# EAGLE design 11Dof (EAGLE 6.2)
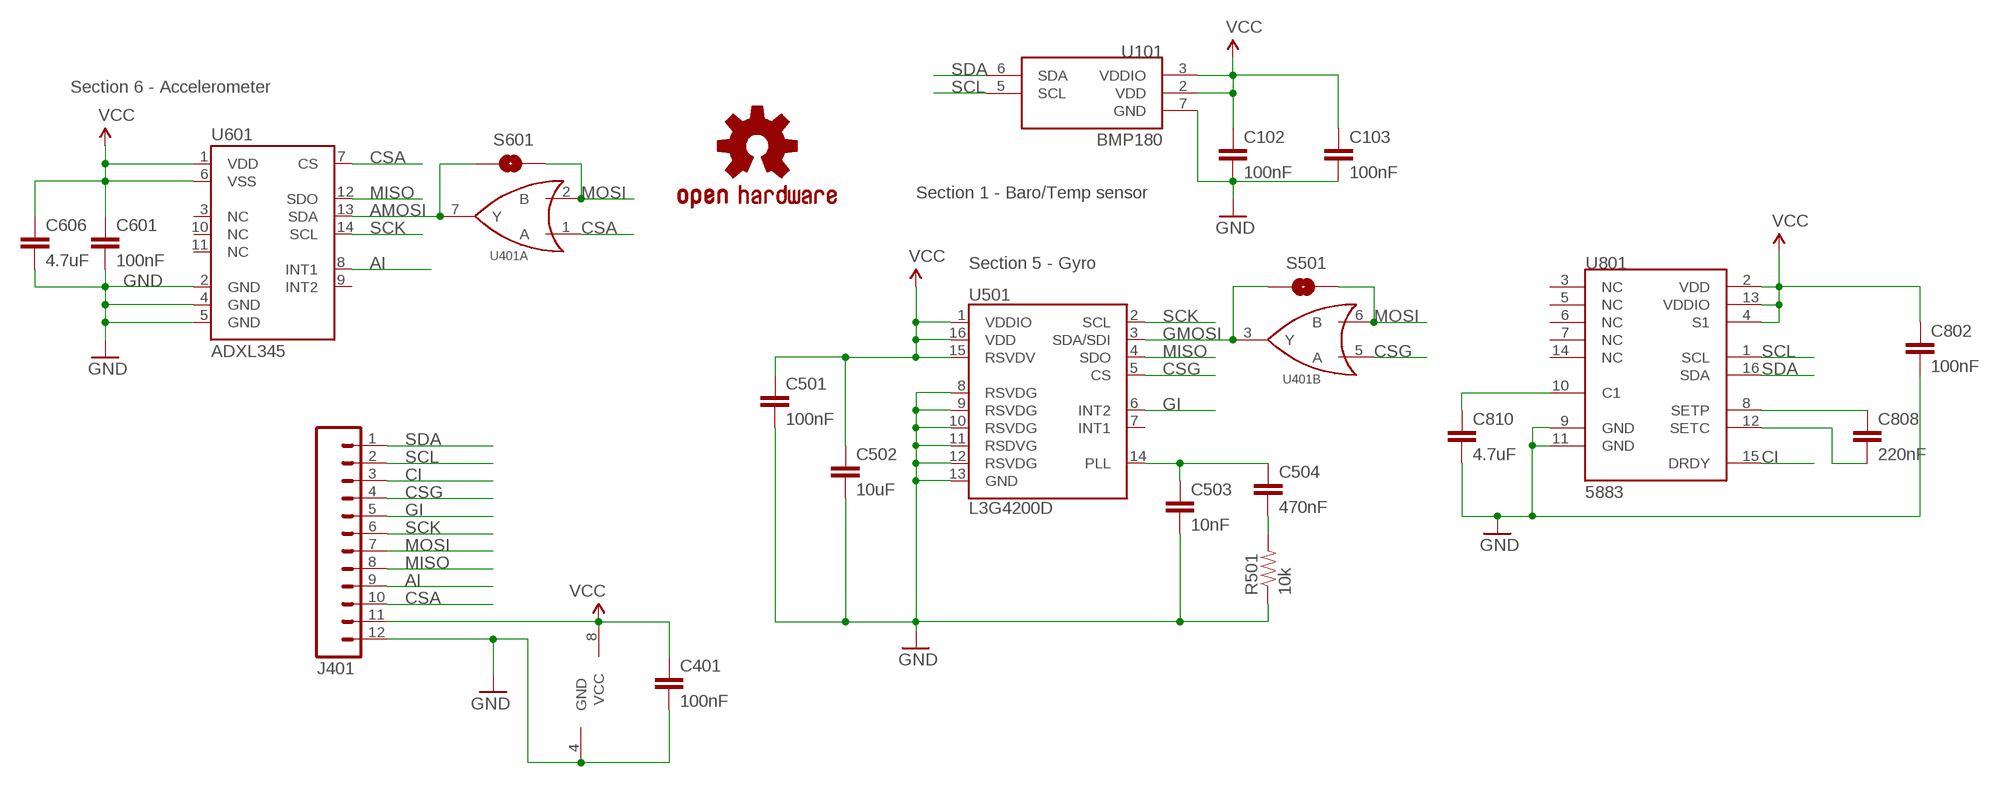
[diagram p0: schematic, sheet 1]

## Parts
C102  100nF  CAP0603-CAP  [0603-CAP]
C103  100nF  CAP0603-CAP  [0603-CAP]
C401  100nF  CAP0603-CAP  [0603-CAP]
C501  100nF  CAP0603-CAP  [0603-CAP]
C502  10uF  CAP0603-CAP  [0603-CAP]
C503  10nF  CAP0603-CAP  [0603-CAP]
C504  470nF  CAP0603-CAP  [0603-CAP]
C601  100nF  CAP0603-CAP  [0603-CAP]
C606  4.7uF  CAP0603-CAP  [0603-CAP]
C802  100nF  CAP0603-CAP  [0603-CAP]
C808  220nF  CAP0603-CAP  [0603-CAP]
C810  4.7uF  CAP0603-CAP  [0603-CAP]
J401  M12PTH  [1X12]
R501  10k  RESISTOR0603-RES  [0603-RES]
S501  SOLDERJUMPERNO  [SJ_2S-NO]
S601  SOLDERJUMPERNO  [SJ_2S-NO]
U101  BMP180  [BMP180]
U401  7432  SN74LVC2G32  [DCU_8]
U501  L3G4200D  [LGA16-4X4]
U601  ADXL345  [LGA14]
U801  5883  HMC5883LSMD  [16LPCC]
U$2  OSHW-LOGOS  [OSHW-LOGO-S]

## Nets
AI: J401.9 U601.8(INT1)
AMOSI: S601.1 U401.7(A:Y) U601.13(SDA)
CI: J401.3 U801.15(DRDY)
CSA: J401.10 U401.1(A:A) U601.7(CS)
CSG: J401.4 U401.5(B:A) U501.5(CS)
GI: J401.5 U501.6(INT2)
GMOSI: S501.1 U401.3(B:Y) U501.3(SDA/SDI)
GND: C102.2 C103.2 C401.2 C501.2 C502.2 C503.2 C601.2 C606.2 C802.2 C810.2 J401.12 R501.1 U101.7(GND) U401.4(PWR:GND) U501.8(RSVDG) U501.9(RSVDG) U501.10(RSVDG) U501.11(RSDVG) U501.12(RSVDG) U501.13(GND) U601.2(GND) U601.4(GND) U601.5(GND) U801.9(GND) U801.11(GND)
MISO: J401.8 U501.4(SDO) U601.12(SDO)
MOSI: J401.7 S501.2 S601.2 U401.2(A:B) U401.6(B:B)
N$1: C503.1 C504.1 U501.14(PLL)
N$2: C504.2 R501.2
N$14: C808.1 U801.8(SETP)
N$15: C808.2 U801.12(SETC)
N$16: C810.1 U801.10(C1)
SCK: J401.6 U501.2(SCL) U601.14(SCL)
SCL: J401.2 U101.5(SCL) U801.1(SCL)
SDA: J401.1 U101.6(SDA) U801.16(SDA)
VCC [POWER]: C102.1 C103.1 C401.1 C501.1 C502.1 C601.1 C606.1 C802.1 J401.11 U101.2(VDD) U101.3(VDDIO) U401.8(PWR:VCC) U501.1(VDDIO) U501.15(RSVDV) U501.16(VDD) U601.1(VDD) U601.6(VSS) U801.2(VDD) U801.4(S1) U801.13(VDDIO)
Unconnected: U501.7(INT1) U601.3(NC) U601.9(INT2) U601.10(NC) U601.11(NC) U801.3(NC) U801.5(NC) U801.6(NC) U801.7(NC) U801.14(NC)

## Notes on the sheet
- Section 6 - Accelerometer
- Section 1 - Baro/Temp sensor
- Section 5 - Gyro

## Library data of the parts
C102 C103 C401 C501 C601 C802 = SparkFun:CAP: Capacitor Standard 0603 ceramic capacitor, and 0.1" leaded capacitor.; DIGIKEY: 445-1316-1-ND
C502 = SparkFun:CAP: Capacitor Standard 0603 ceramic capacitor, and 0.1" leaded capacitor.; DIGIKEY: 445-7486-1-ND
C503 = SparkFun:CAP: Capacitor Standard 0603 ceramic capacitor, and 0.1" leaded capacitor.; DIGIKEY: 445-1311-1-ND
C504 = SparkFun:CAP: Capacitor Standard 0603 ceramic capacitor, and 0.1" leaded capacitor.; DIGIKEY: 445-5192-1-ND
C606 C810 = SparkFun:CAP: Capacitor Standard 0603 ceramic capacitor, and 0.1" leaded capacitor.; DIGIKEY: 445-7483-1-ND
C808 = SparkFun:CAP: Capacitor Standard 0603 ceramic capacitor, and 0.1" leaded capacitor.; DIGIKEY: 445-5132-1-ND
J401 = SparkFun:M12: Header 12 Standard 12-pin 0.1" header. Use with straight break away headers (SKU : PRT-00116), right angle break away headers (PRT-00553), swiss pins (PRT-00743), machine pins (PRT-00117), and female headers (PRT-00115).; DIGIKEY: $NOPART
R501 = SparkFun:RESISTOR: Resistor Basic schematic elements and footprints for 0603, 1206, and PTH resistors.; DIGIKEY: P10.0KHCT-ND
S501 S601 = SparkFun:SOLDERJUMPER: Solder Jumper Standard SMD solder jumper. Used to automate production. Two varients : Normally Open and Normally Closed are the same, but have different paste layers. NC will have a large amount of paste and should jumper during reflow.; DIGIKEY: $NOPART
U101 = KwanSystems:BMP180; DIGIKEY: 828-1027-1-ND
U401 = KwanSystems:SN74LVC2G32; DIGIKEY: 296-13268-1-ND
U501 = SparkFun:L3G4200D: L3G4200D Three-axis, digital output gyroscope The L3G4200D is a low-power three-axis angular rate sensor, has a full scale of ±250/±500/±2000 dps and is capable of measuring rates with a user-selectable bandwidth. It includes a sensing element and an IC interface capable of providing the measured angular rate to the external world through a digital interface (I2C/SPI). Package: 4x4x1.1 LGA-16 (LGA16-4x4.PAC); DIGIKEY: 497-11071-1-ND
U601 = SparkFun:ADXL345; DIGIKEY: ADXL345BCCZ-RL7CT-ND
U801 = SparkFun:HMC5883L: 3 Axis Digital Compass IC; DIGIKEY: 342-1082-1-ND
U$2 = SparkFun:OSHW-LOGO: Open Source Hardware Logo This logo indicates the piece of hardware it is found on incorporates a OSHW license and/or adheres to the definition of open source hardware found here: http://freedomdefined.org/OSHW; DIGIKEY: $NOPART

## Net classes
0 default: width 0.152 mm, drill 0.33 mm, clearance 0.152 mm
1 POWER: width 0.152 mm, drill 0.33 mm, clearance 0.152 mm
2 hv: width 0.152 mm, drill 0.33 mm, clearance 0.152 mm

## Board
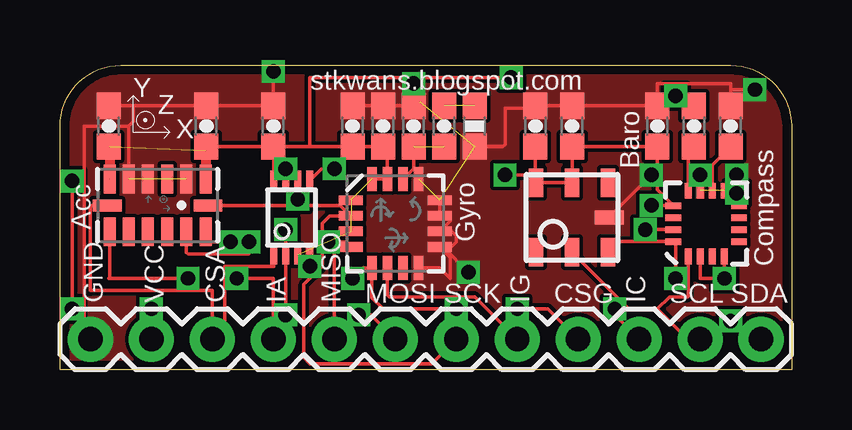
[diagram p1: board, top side]
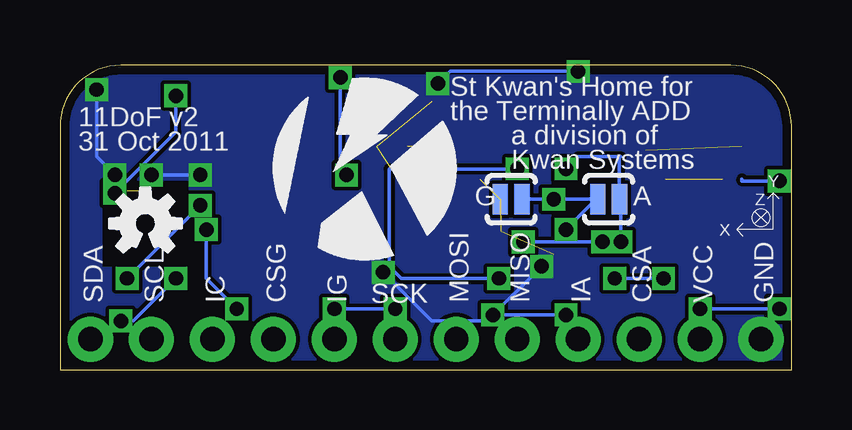
[diagram p2: board, bottom side, seen from below]

Size 30.48 x 12.7 mm. Coordinates in mm from the lower left corner, seen from the top.
Outline: 0,0 0,10.16 arc-90 2.54,12.7 27.94,12.7 arc-90 30.48,10.16 30.48,0 0,0
Copper layers (1*16): Top 0.0356mm / dielectric 1.5011mm / Bottom 0.0356mm
Design rules "default": minimum track width 6mil, minimum drill 13mil, track to track 6mil, track to pad 6mil, pad to pad 6mil, via to via 6mil, smd to smd 6mil, copper to edge 15mil, drill to drill 6mil, minimum pad ring 7mil, minimum via ring 7mil, stop-mask expansion 4mil, vias tented up to drill 14mil, thermal gap 10mil
tRestrict: area 25.1,7.1 to 25.9,7.9; area 27.9,7.1 to 28.7,7.9; area 27.9,4.3 to 28.7,5.1; area 25.1,4.3 to 25.9,5.1; area 25.9,5.1 to 27.9,7.1
bRestrict: area 25.1,4.3 to 28.7,7.9
vRestrict: area 0.8,2.8 to 1.8,4.8; area 3.3,2.8 to 4.3,4.8; area 5.8,2.8 to 6.9,4.8; area 8.4,2.8 to 9.4,3.8; area 10.9,2.8 to 11.7,5.3; area 12.7,2.8 to 15.2,3.6; area 13.5,3.6 to 14.2,5.3; area 15.5,2.8 to 18,3.6; area 18.5,2.8 to 19.6,3.8; area 20.6,2.8 to 22.6,3.6; area 21.1,3.6 to 21.8,4.8; area 23.6,2.8 to 24.4,3.8; 21 more areas

### Footprints (pad centres in the part's own frame; a part is rotated, then mirrored left to right if it is on the bottom)
0603-CAP = smd 1.1 x 1: 1 -0.85,0; 2 0.85,0
1X12 = drill 1.016 pad 1.88: 1 0,0; 2 2.54,0; 3 5.08,0; 4 7.62,0; 5 10.16,0; 6 12.7,0; 7 15.24,0; 8 17.78,0; 9 20.32,0; 10 22.86,0; 11 25.4,0; 12 27.94,0
0603-RES = smd 1.1 x 1: 1 -0.85,0; 2 0.85,0
SJ_2S-NO = smd 0.635 x 1.27: 1 -0.45,0; 2 0.45,0
BMP180 = smd 0.6 x 1.2: 1 1.5,1.45; 2 0,1.45; 3 -1.5,1.45; 4 -1.5,-1.45; 5 0,-1.45; 6 1.5,-1.45 | smd 1.2 x 0.6: 7 1.55,0
DCU_8 = smd 0.3 x 0.8: 1 -0.75,-1.55; 2 -0.25,-1.55; 3 0.25,-1.55; 4 0.75,-1.55; 5 0.75,1.55; 6 0.25,1.55; 7 -0.25,1.55; 8 -0.75,1.55
LGA16-4X4 = smd 1 x 0.4: 1 -1.85,0.975; 2 -1.85,0.325; 3 -1.85,-0.325; 4 -1.85,-0.975; 9 1.85,-0.975; 10 1.85,-0.325; 11 1.85,0.325; 12 1.85,0.975 | smd 0.4 x 1: 5 -0.975,-1.85; 6 -0.325,-1.85; 7 0.325,-1.85; 8 0.975,-1.85; 13 0.975,1.85; 14 0.325,1.85; 15 -0.325,1.85; 16 -0.975,1.85
LGA14 = smd 0.5 x 1.2: 1 2,1.1; 2 1.2,1.1; 3 0.4,1.1; 4 -0.4,1.1; 5 -1.2,1.1; 6 -2,1.1; 8 -2,-1.1; 9 -1.2,-1.1; 10 -0.4,-1.1; 11 0.4,-1.1; 12 1.2,-1.1; 13 2,-1.1 | smd 1.2 x 0.5: 7 -2.1,0; 14 2.1,0
16LPCC = smd 0.65 x 0.28: 1 -1.37,0.75; 2 -1.37,0.25; 3 -1.37,-0.25; 4 -1.37,-0.75; 9 1.37,-0.75; 10 1.37,-0.25; 11 1.37,0.25; 12 1.37,0.75 | smd 0.28 x 0.65: 5 -0.75,-1.37; 6 -0.25,-1.37; 7 0.25,-1.37; 8 0.75,-1.37; 13 0.75,1.37; 14 0.25,1.37; 15 -0.25,1.37; 16 -0.75,1.37

### Placement (x,y rotation side)
C102  21.34,10.16 90 top
C103  19.81,10.16 90 top
C401  8.89,10.16 90 top
C501  13.46,10.16 90 top
C502  12.19,10.16 90 top
C503  14.73,10.16 90 top
C504  16,10.16 90 top
C601  6.1,10.16 90 top
C606  2.03,10.16 90 top
C802  24.89,10.16 90 top
C808  26.42,10.16 270 top
C810  27.94,10.16 90 top
J401  29.21,1.27 180 top
R501  17.27,10.16 90 top
S501  11.68,7.11 0 bottom
S601  7.62,7.11 180 bottom
U101  21.34,6.35 0 top
U401  9.65,6.35 0 top
U501  13.97,6.1 0 top
U601  4.06,6.86 0 top
U801  26.92,6.1 90 top
U$1  [KWAN_CIRCLE]  17.78,8.38 0 bottom
U$2  26.92,6.1 0 bottom

### Tracks (layer width: path | path; a pad name or v marks a point on that pad's centre or on a via)
AI  (via drill 0.6)
  Top 0.152: J401.9 8.89,3.81 v7.37,3.81 | v5.33,3.81 2.03,3.81 2.06,3.84 U601.8
  Bottom 0.152: v7.37,3.81 v5.33,3.81
AMOSI  (via drill 0.6)
  Top 0.152: U401.7 v9.4,8.38 | v7.11,5.33 6.1,5.33 6.06,5.37 U601.13
  Bottom 0.152: v9.4,8.38 8.89,8.89 7.11,8.89 7.17,8.83 S601.1 7.11,7.05 v7.11,5.33
CI  (via drill 0.6)
  Top 0.152: J401.3 23.11,2.29 v23.11,2.54 | v24.38,5.84 v24.39,5.85 U801.15
  Bottom 0.152: v23.11,2.54 24.38,3.81 v24.38,5.84
CSA
  Top 0.152: U601.7 1.27,6.86 1.27,3.3 6.35,3.3 J401.10 6.86,1.27 | 7.11,1.27 6.86,1.27 | 6.86,1.27 6.86,4.32 8.9,4.32 U401.1
CSG  (via drill 0.6)
  Top 0.152: J401.4 20.32,2.54 v19.05,2.54 | v16.51,2.54 13.46,2.54 12.99,3.01 U501.5 12.63,4.25 v12.19,3.81 | U401.5 10.88,8.38 v11.43,8.38
  Bottom 0.152: v19.05,2.54 v16.51,2.54 | v11.43,8.38 16.76,8.38 16.76,4.32 16.26,3.81 v12.19,3.81
GI
  Top 0.152: J401.5 17.27,3.05 13.72,3.05 13.64,3.12 U501.6
GMOSI  (2 unrouted)
GND  (via drill 0.6)  (6 unrouted)
  Top 0.152: J401.12 1.02,1.27 1.02,10.16 2.86,10.16 | 2.86,10.16 U601.5 | R501.1 18.45,9.31 18.54,9.4 18.54,10.92 19.72,10.92 C103.2 C102.2 C802.2 24.89,11.94 27.94,11.94 27.94,11.68 | 27.94,11.68 C810.2 | U801.9 28.19,7.99 v28.19,8.13 | v28.96,11.68 27.94,11.68 | U801.11 v26.67,8.13 | v24.64,8.13 22.89,6.38 U101.7 | U401.4 10.41,4.79 v10.41,4.32 | v17.02,4.06 15.96,5.12 U501.9 | U501.9 15.86,5.08 16.26,5.08 16.51,5.33 16.51,5.59 16.33,5.77 U501.10 16.26,6.21 16.26,6.35 16.18,6.42 U501.11 U501.12 | U501.9 16.26,4.68 16.26,3.81 15.82,4.25 U501.8 | C503.2 C501.2 C502.2 | C503.2 v14.73,11.94 | v8.89,12.45 C401.2 C601.2 3.05,11.01 | C503.2 14.9,11.18 14.99,11.18 | 3.05,11.01 C606.2 | 2.86,10.16 3.05,10.34 3.05,11.01
  Bottom 0.152: v28.19,8.13 28.96,8.89 v28.96,11.68 | v26.67,8.13 v24.64,8.13 | v10.41,4.32 12.7,2.03 14.99,2.03 v17.02,4.06 | v14.73,11.94 14.22,12.45 v8.89,12.45
  pour Bottom (no thermals): 2.54,12.7 27.94,12.7 arc-90 30.48,10.16 30.48,0 0,0 0,10.16 arc-90
  pour Top (no thermals): 2.54,12.7 27.94,12.7 arc-90 30.48,10.16 30.48,0 0,0 0,10.16 arc-90
MISO  (via drill 0.6)
  Top 0.152: J401.8 11.43,5.08 11.47,5.12 U501.4 11.91,5.33 v11.18,5.33 | v7.87,5.33 7.87,4.83 5.33,4.83 5.26,4.9 U601.12
  Bottom 0.152: v11.18,5.33 v7.87,5.33
MOSI  (via drill 0.6)
  Top 0.152: J401.7 12.95,2.29 v12.45,2.29 | v9.4,2.29 U401.2 v9.4,5.84 | U401.6 v9.91,7.11
  Bottom 0.152: v12.45,2.29 v9.4,2.29 | v9.4,5.84 8.13,7.11 S601.2 v9.91,7.11 S501.2
N$1  (1 unrouted)
  Top 0.152: U501.14 14.73,8.38 C503.1
N$2  (1 unrouted)
N$14  (via drill 0.6)
  Top 0.152: U801.8 28.19,6.95 v28.19,7.37 | v25.65,11.43 26.07,11.01 C808.1
  Bottom 0.152: v28.19,7.37 25.65,9.91 v25.65,11.43
N$15
  Top 0.152: C808.2 26.17,9.07 U801.12
N$16
  Top 0.152: C810.1 27.17,8.54 U801.10
SCK
  Top 0.152: J401.6 15.49,0.25 10.41,0.25 10.16,0.51 10.16,3.56 10.92,4.32 10.92,6.1 11.25,6.42 U501.2 11.68,6.86 U601.14
SCL
  Top 0.152: U101.5 23.7,2.54 24.89,2.54 | 24.89,2.54 26.16,1.27 J401.2 | 24.89,2.54 25.4,3.05 26.16,3.05 26.17,3.06 U801.1
SDA  (via drill 0.6)
  Top 0.152: U101.6 23.28,5.35 U801.16 25.65,5.25 v25.65,3.81 | v27.94,2.03 28.7,1.27 J401.1
  Bottom 0.152: v25.65,3.81 27.43,2.03 v27.94,2.03
VCC  (via drill 0.6)  (3 unrouted)
  Top 0.152: J401.11 v3.81,2.54 | v0.51,2.54 v0.51,7.87 | C401.1 8.9,9.3 U401.8 | C401.1 C601.1 | C401.1 10.41,9.31 | 10.41,9.31 C502.1 C501.1 13.64,9.13 U501.15 U501.16 | 19.81,7.82 U101.3 U101.2 C102.1 C802.1 24.89,7.51 U801.13 v24.64,6.86 | 19.81,7.82 C103.1 | U801.4 27.67,3.82 v27.69,3.81 26.67,3.81 U801.2 | 19.81,7.82 19.51,8.13 v18.54,8.13 | v18.8,12.19 10.41,12.19 10.41,9.31
  Top 0.406: C606.1 2.06,9.31 U601.6 | C601.1 6.1,9.14 6.06,9.14 U601.1
  Bottom 0.152: v3.81,2.54 v0.51,2.54 | v0.51,7.87 2.06,7.87 U601.6 | v24.64,6.86 v27.69,3.81 | v18.54,8.13 18.8,8.38 v18.8,12.19

### Text on the board
tPlace: Y | stkwans.blogspot.com | Z | X | Baro | Acc | Gyro | Compass | GND | VCC | CSA | IA | MISO | MOSI | SCK | IG | CSG | IC | SCL | SDA
bPlace: St Kwan's Home for | the Terminally ADD | 11DoF v2 | a division of | 31 Oct 2011 | Y | Kwan Systems | Z | A | G | X | GND | VCC | CSA | IA | MISO | MOSI | SCK | IG | CSG | IC | SCL | SDA